# Altium schematic sheet Sincronismo.SchDoc: GRUPO ALTECH
size A3; DocumentNumber: GA0070; SheetNumber: 2; SheetTotal: 4; PageSetup: Record=PageOptions|CenterHorizontal=True|CenterVertical=True|PrintScale=0.71|XCorrection=1.00|YCorrection=1.00|PrintKind=0|BorderSize=5000000|LeftOffset=0|BottomOffset=0|Orientation=2|PaperLength=1000|PaperWidth=1000|Scale=100|PaperSource=7|PrintQuality=-3|MediaType=1|DitherType=10|PrintScaleMode=1|PaperKind=A4|PaperIndex=9
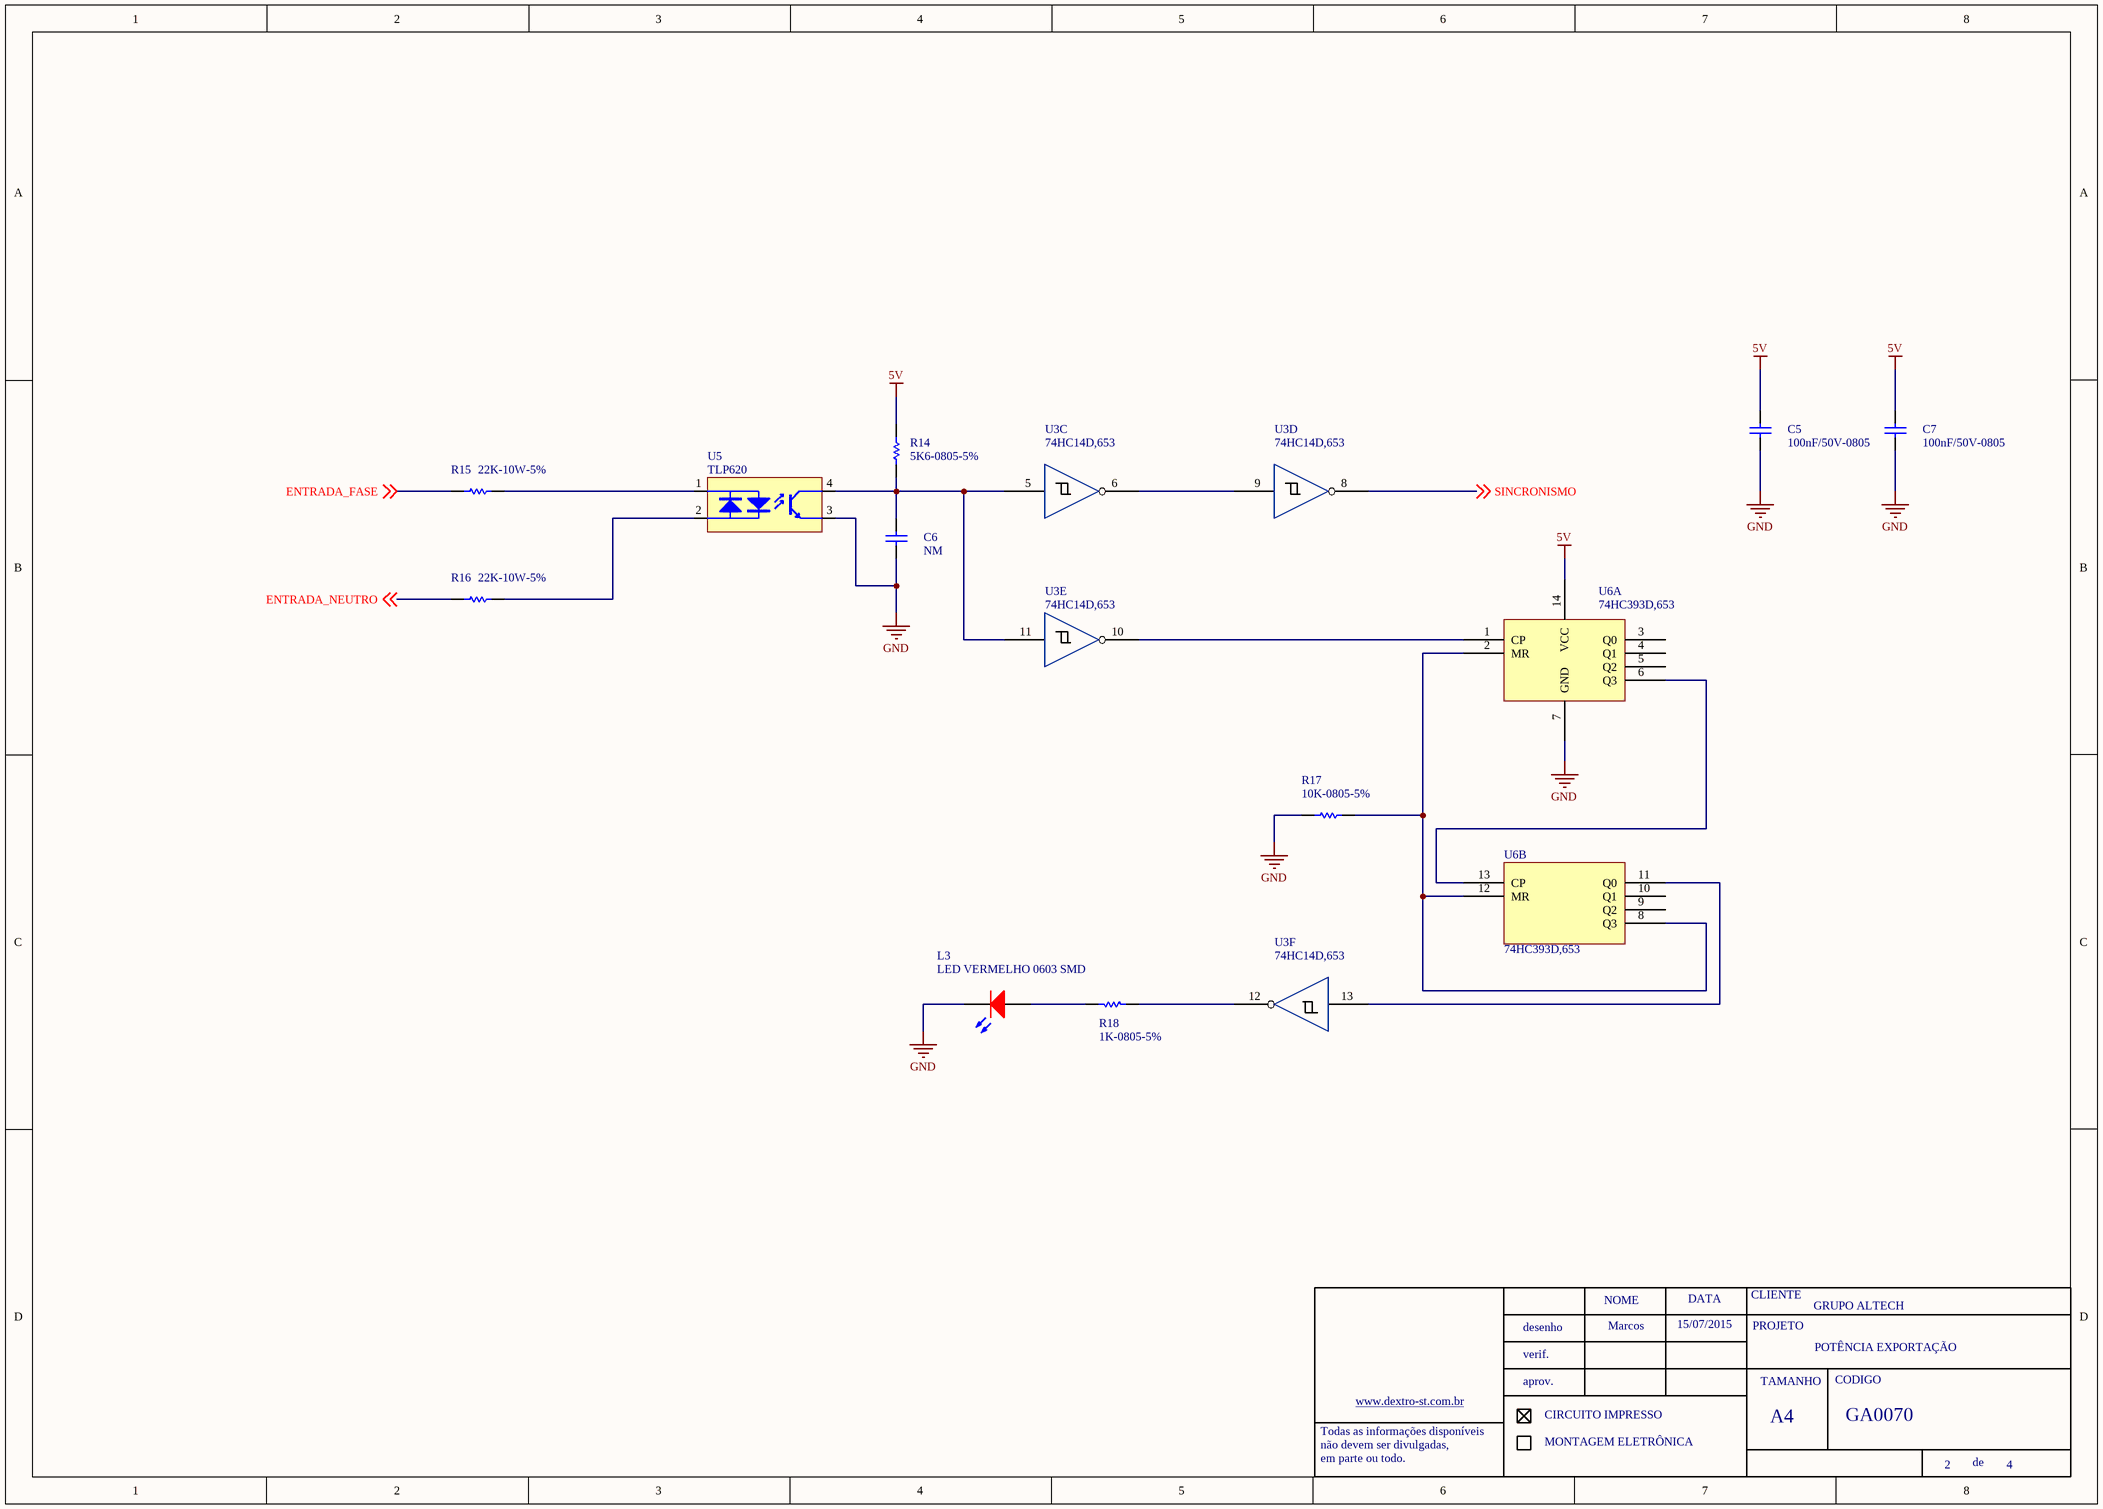
[diagram p0: Sincronismo.SchDoc]

## Parts
C5  100nF/50V-0805  [0805-REVISADO ONDA]
C6  NM  [0805-REVISADO ONDA]
C7  100nF/50V-0805  [0805-REVISADO ONDA]
L3  LED VERMELHO 0603 SMD  [LED 1206]
R14  5K6-0805-5%  [0805-REVISADO ONDA]
R15  22K-10W-5%  [RESISTOR 10W CERAMICO]
R16  22K-10W-5%  [RESISTOR 10W CERAMICO]
R17  10K-0805-5%  [0805-REVISADO ONDA]
R18  1K-0805-5%  [0805-REVISADO ONDA]
U3  74HC14D,653  [SOIC 14 PINOS]  (parts C,D,E,F of 6)
U5  TLP620  [DIP-4]
U6  74HC393D,653  [SOIC 14 PINOS]  (parts A,B of 2)

## Nets
5V: C5.2 C7.2 R14.2 U6.14(VCC)
GND: C5.1 C6.1 C7.1 L3.2(K) R17.1 U5.3(E) U6.7(GND)
ENTRADA_FASE: R15.1 ; off-sheet ENTRADA_FASE
ENTRADA_NEUTRO: R16.1 ; off-sheet ENTRADA_NEUTRO
SINCRONISMO: U3.8 ; off-sheet SINCRONISMO
NetC6_2: C6.2 R14.1 U3.5 U3.11 U5.4(C)
NetL3_1: L3.1(A) R18.2
NetR15_2: R15.2 U5.1(A)
NetR16_2: R16.2 U5.2(K)
NetR17_2: R17.2 U6.2(MR) U6.8(Q3) U6.12(MR)
NetR18_1: R18.1 U3.12
NetU3_6: U3.6 U3.9
NetU3_10: U3.10 U6.1(CP)
NetU3_13: U3.13 U6.11(Q0)
NetU6_6: U6.6(Q3) U6.13(CP)

Not connected (* = marked no-connect by the designer): U6 3(Q0) 4(Q1) 5(Q2) 9(Q2) 10(Q1)

## Notes on the sheet
- Marcos
- 15/07/2015
- POTÊNCIA EXPORTAÇÃO
- NOME
- DATA
- CLIENTE
- PROJETO
- desenho
- verif.
- aprov.
- TAMANHO
- CODIGO
- Todas as informações disponíveis
- não devem ser divulgadas,
- em parte ou todo.
- www.dextro-st.com.br
- CIRCUITO IMPRESSO
- MONTAGEM ELETRÔNICA
- A4
- de

## Library data of the parts
C5-C7 = 100nF/50-0805-NPO: ERP: 104.11.005
R14-R16 = 22K-0805-5%: ERP: 102.11.058
U3 = 74HC14D
U5 = PC814
U6 = 74HC393
L3 = LED VERMELHO 0603 SMD: ERP: 124.02.010
R17 = 10K-0805-5%: ERP: 102.11.054
R18 = 1K-0805-5%: ERP: 102.11.042